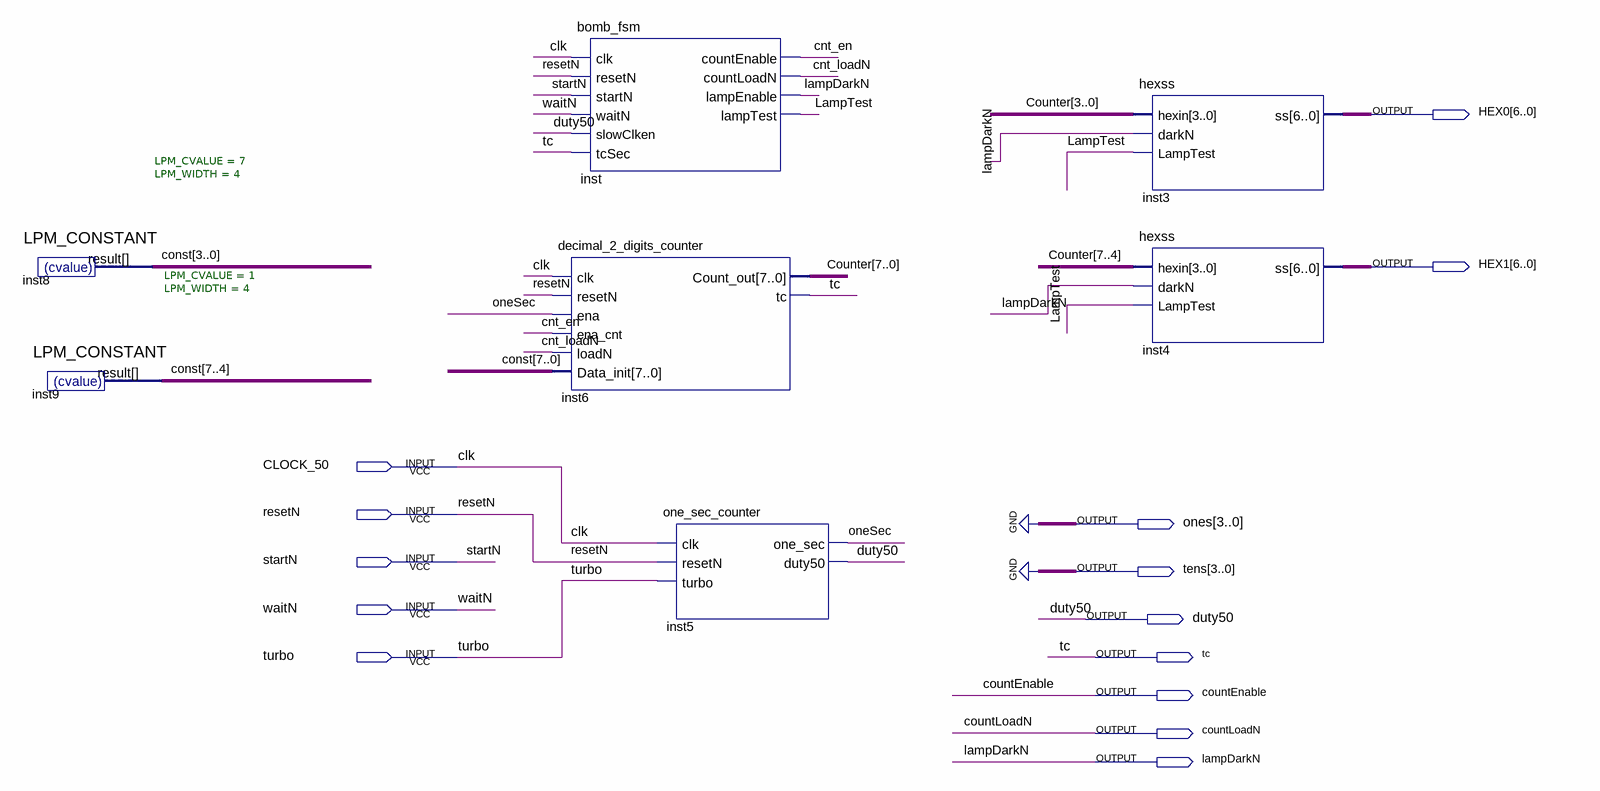
[diagram p0: schematic sheet]
// Quartus schematic topBomb.bdf as structural Verilog: 7 symbols, 14 pins
module topBomb (
  input  CLOCK_50,
  input  resetN,
  input  startN,
  input  waitN,
  input  turbo,
  output [6:0] HEX0,
  output [6:0] HEX1,
  output [3:0] ones,
  output [3:0] tens,
  output duty50,
  output tc,
  output countEnable,
  output countLoadN,
  output lampDarkN
);

  wire cnt_en, cnt_loadN, LampTest, oneSec;
  wire [7:0] \const , Counter;

  LPM_CONSTANT #(.LPM_CVALUE(7), .LPM_WIDTH(4)) inst8 (.result(\const [3:0]));
  LPM_CONSTANT #(.LPM_CVALUE(1), .LPM_WIDTH(4)) inst9 (.result(\const [7:4]));
  bomb_fsm inst (
    .clk(CLOCK_50), .resetN(resetN), .startN(startN), .waitN(waitN), .slowClken(duty50), .tcSec(tc),
    .countEnable(cnt_en), .countLoadN(cnt_loadN), .lampEnable(lampDarkN), .lampTest(LampTest));
  decimal_2_digits_counter inst6 (
    .clk(CLOCK_50), .resetN(resetN), .ena(oneSec), .ena_cnt(cnt_en), .loadN(cnt_loadN), .Data_init(\const ),
    .Count_out(Counter), .tc(tc));
  one_sec_counter inst5 (.clk(CLOCK_50), .resetN(resetN), .turbo(turbo), .one_sec(oneSec), .duty50(duty50));
  hexss inst3 (.hexin(Counter[3:0]), .darkN(lampDarkN), .LampTest(LampTest), .ss(HEX0));
  hexss inst4 (.hexin(Counter[7:4]), .darkN(lampDarkN), .LampTest(LampTest), .ss(HEX1));

  assign ones = 4'b0000;
  assign tens = 4'b0000;

  // Other names for the same wires on the sheet: clk = CLOCK_50
endmodule
